# EAGLE design bike_led (EAGLE 7.3.0)
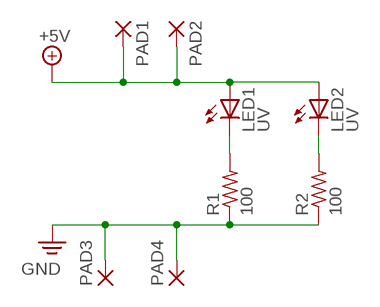
[diagram p0: schematic, sheet 1]

## Parts
LED1  UV  LEDSMT1206  [1206]
LED2  UV  LEDSMT1206  [1206]
PAD1  SMD5  [SMD2,54-5,08]
PAD2  SMD5  [SMD2,54-5,08]
PAD3  SMD5  [SMD2,54-5,08]
PAD4  SMD5  [SMD2,54-5,08]
R1  100  R-US_R1206  [R1206]
R2  100  R-US_R1206  [R1206]

## Nets
+5V: LED1.A LED2.A PAD1.1(P) PAD2.1(P)
GND: PAD3.1(P) PAD4.1(P) R1.1 R2.1
N$2: LED2.C R2.2
N$3: LED1.C R1.2

## Library data of the parts
LED1 LED2 = adafruit:LED: LED OSRAM: - CHIPLED LG R971, LG N971, LY N971, LG Q971, LY Q971, LO R971, LY R971 LH N974, LH R974 LS Q976, LO Q976, LY Q976 LO Q996 - Hyper CHIPLED LW Q18S LB Q993, LB Q99A, LB R99A - SideLED LS A670, LO A670, LY A670, LG A670, LP A670 LB A673, LV A673, LT A673, LW A673 LH A674 LY A675 LS A676, LA A676, LO A676, LY A676, LW A676 LS A679, LY A679, LG A679 - Hyper Micro SIDELED® LS Y876, LA Y876, LO Y876, LY Y876 LT Y87S - SmartLED LW L88C, LW L88S LB L89C, LB L89S, LG L890 LS L89K, LO L89K, LY L89K LS L896, LA L896, LO L896, LY L896 - TOPLED LS T670, LO T670, LY T670, LG T670, LP T670 LSG T670, LSP T670, LSY T670, LOP T670, LYG T670 LG T671, LOG T671, LSG T671 LB T673, LV T673, LT T673, LW T673 LH T674 LS T676, LA T676, LO T676, LY T676, LB T676, LH T676, LSB T676, LW T676 LB T67C, LV T67C, LT T67C, LS T67K, LO T67K, LY T67K, LW E67C LS E67B, LA E67B, LO E67B, LY E67B, LB E67C, LV E67C, LT E67C LW T67C LS T679, LY T679, LG T679 LS T770, LO T770, LY T770, LG T770, LP T770 LB T773, LV T773, LT T773, LW T773 LH T774 LS E675, LA E675, LY E675, LS T675 LS T776, LA T776, LO T776, LY T776, LB T776 LHGB T686 LT T68C, LB T68C - Hyper Mini TOPLED® LB M676 - Mini TOPLED Santana® LG M470 LS M47K, LO M47K, LY M47K Source: http://www.osram.convergy.de/
PAD1-PAD4 = wirepad:SMD5: SMD PAD
R1 R2 = adafruit:R-US_: RESISTOR, American symbol

## Net classes
0 default: clearance 0.205 mm

## Board
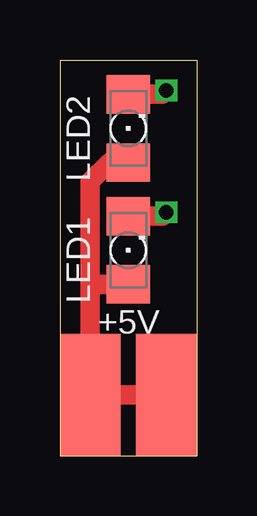
[diagram p1: board, top side]
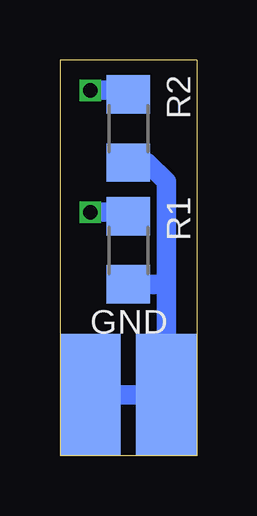
[diagram p2: board, bottom side, seen from below]

Size 5.71 x 16.51 mm. Coordinates in mm from the lower left corner, seen from the top.
Outline: 0,16.5 0,0 5.71,0 5.71,16.5
Outline: 0,16.51 5.71,16.51
Copper layers (1*16): Top 0.035mm / dielectric 1.5mm / Bottom 0.035mm
Design rules "shematic": minimum track width 6mil, minimum drill 12mil, track to track 0.205mm, track to pad 0.205mm, pad to pad 0.205mm, via to via 0.205mm, smd to smd 0mil, copper to edge 10mil, drill to drill 10mil, minimum pad ring 10mil, minimum via ring 6mil, stop-mask expansion 2mil, vias tented up to drill 100mil, thermal gap 10mil

### Footprints (pad centres in the part's own frame; a part is rotated, then mirrored left to right if it is on the bottom)
1206 = smd 1.6 x 1.803: A -1.422,0; C 1.422,0
SMD2,54-5,08 = smd 2.54 x 5.08: 1 0,0
R1206 = smd 1.6 x 1.803: 1 -1.422,0; 2 1.422,0

### Placement (x,y rotation side)
LED1  2.86,8.57 90 top
LED2  2.86,13.65 90 top
PAD1  4.45,2.54 180 top
PAD2  1.27,2.54 0 top
PAD3  1.27,2.54 0 bottom
PAD4  4.45,2.54 0 bottom
R1  2.86,8.57 90 bottom
R2  2.86,13.65 90 bottom

### Tracks (layer width: path | path; a pad name or v marks a point on that pad's centre or on a via)
+5V
  Top 0.813: LED2.A 2.07,12.23 1.27,11.43 1.27,6.99 | 1.27,6.99 PAD2.1 PAD1.1 | LED1.A 1.44,7.15 1.27,6.99
GND
  Bottom 0.813: R2.1 2.07,12.23 1.27,11.43 1.27,6.99 | 1.27,6.99 PAD3.1 PAD4.1 | R1.1 1.44,7.15 1.27,6.99
N$2  (via drill 0.6)
  Top 0.406: 3.81,15.07 v4.45,15.24
  Top 0.813: LED2.C 3.81,15.07 4.28,15.07 v4.45,15.24
  Bottom 0.406: LED2.C 4.45,15.07 v4.45,15.24
  Bottom 0.813: v4.45,15.24 3.17,15.24
N$3  (via drill 0.6)
  Top 0.813: R1.2 4.28,9.99 v4.45,10.16
  Bottom 0.406: R1.2 4.45,9.99 v4.45,10.16
  Bottom 0.813: v4.45,10.16 3.17,10.16

### Text on the board
tNames: LED2 | LED1 | +5V
bNames: R2 | R1 | GND